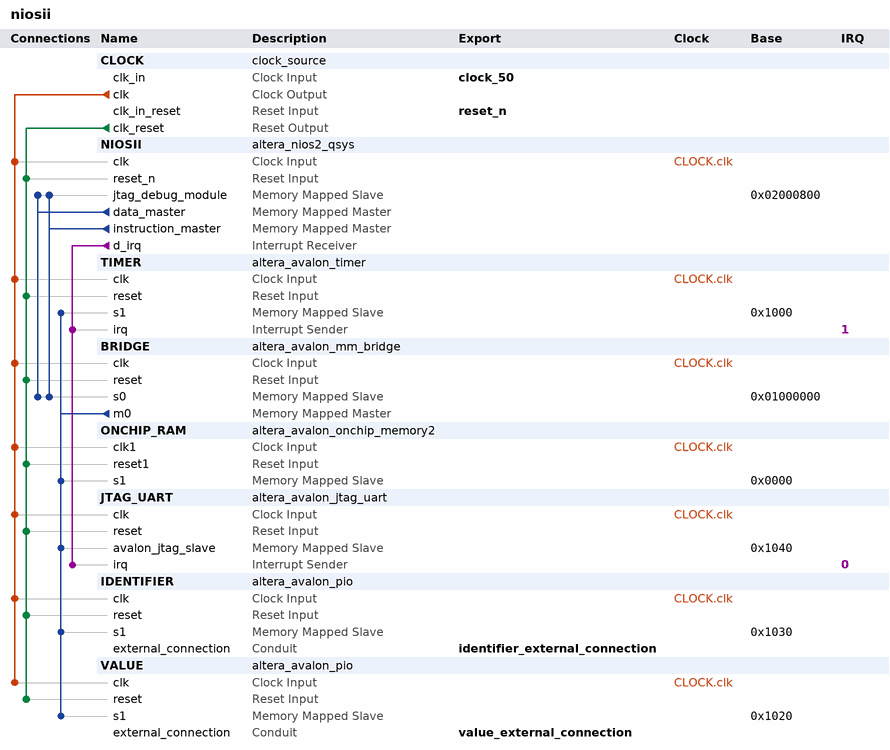
[diagram p0: system contents]
# Platform Designer (Qsys) system niosii, Cyclone IV E EP4CE55F23C6
# Parameters at their usual value, and those the tool derives, are not listed.
package require -exact qsys 13.0.1.99.2
create_system niosii
set_project_property DEVICE_FAMILY {Cyclone IV E}
set_project_property DEVICE EP4CE55F23C6

add_instance CLOCK clock_source 13.0
set_instance_parameter_value CLOCK clockFrequency 50000000

add_instance NIOSII altera_nios2_qsys 13.0
set_instance_parameter_value NIOSII resetSlave ONCHIP_RAM.s1
set_instance_parameter_value NIOSII mmu_TLBMissExcSlave None
set_instance_parameter_value NIOSII exceptionSlave ONCHIP_RAM.s1
set_instance_parameter_value NIOSII breakSlave NIOSII.jtag_debug_module
set_instance_parameter_value NIOSII impl Tiny
set_instance_parameter_value NIOSII icache_size 4096

add_instance TIMER altera_avalon_timer 13.0.1.99.2
set_instance_parameter_value TIMER period 1
set_instance_parameter_value TIMER periodUnits MSEC

add_instance BRIDGE altera_avalon_mm_bridge 13.0
set_instance_parameter_value BRIDGE DATA_WIDTH 32
set_instance_parameter_value BRIDGE ADDRESS_WIDTH 16
set_instance_parameter_value BRIDGE ADDRESS_UNITS SYMBOLS
set_instance_parameter_value BRIDGE MAX_PENDING_RESPONSES 4

add_instance ONCHIP_RAM altera_avalon_onchip_memory2 13.0.1.99.2
set_instance_parameter_value ONCHIP_RAM dataWidth 32
set_instance_parameter_value ONCHIP_RAM dualPort false
set_instance_parameter_value ONCHIP_RAM initMemContent true
set_instance_parameter_value ONCHIP_RAM initializationFileName onchip_mem.hex
set_instance_parameter_value ONCHIP_RAM memorySize 4096

add_instance JTAG_UART altera_avalon_jtag_uart 13.0.1.99.2
set_instance_parameter_value JTAG_UART simInteractiveOptions NO_INTERACTIVE_WINDOWS

add_instance IDENTIFIER altera_avalon_pio 13.0.1.99.2
set_instance_parameter_value IDENTIFIER direction Output
set_instance_parameter_value IDENTIFIER width 32

add_instance VALUE altera_avalon_pio 13.0.1.99.2
set_instance_parameter_value VALUE direction Output
set_instance_parameter_value VALUE width 32

# connections
add_connection CLOCK.clk BRIDGE.clk clock
add_connection CLOCK.clk IDENTIFIER.clk clock
add_connection CLOCK.clk JTAG_UART.clk clock
add_connection CLOCK.clk NIOSII.clk clock
add_connection CLOCK.clk ONCHIP_RAM.clk1 clock
add_connection CLOCK.clk TIMER.clk clock
add_connection CLOCK.clk VALUE.clk clock
add_connection CLOCK.clk_reset BRIDGE.reset reset
add_connection CLOCK.clk_reset IDENTIFIER.reset reset
add_connection CLOCK.clk_reset JTAG_UART.reset reset
add_connection CLOCK.clk_reset NIOSII.reset_n reset
add_connection CLOCK.clk_reset ONCHIP_RAM.reset1 reset
add_connection CLOCK.clk_reset TIMER.reset reset
add_connection CLOCK.clk_reset VALUE.reset reset
add_connection BRIDGE.m0 IDENTIFIER.s1 avalon
set_connection_parameter_value BRIDGE.m0/IDENTIFIER.s1 baseAddress 0x1030
add_connection BRIDGE.m0 JTAG_UART.avalon_jtag_slave avalon
set_connection_parameter_value BRIDGE.m0/JTAG_UART.avalon_jtag_slave baseAddress 0x1040
add_connection BRIDGE.m0 ONCHIP_RAM.s1 avalon
set_connection_parameter_value BRIDGE.m0/ONCHIP_RAM.s1 baseAddress 0x0000
add_connection BRIDGE.m0 TIMER.s1 avalon
set_connection_parameter_value BRIDGE.m0/TIMER.s1 baseAddress 0x1000
add_connection BRIDGE.m0 VALUE.s1 avalon
set_connection_parameter_value BRIDGE.m0/VALUE.s1 baseAddress 0x1020
add_connection NIOSII.data_master BRIDGE.s0 avalon
set_connection_parameter_value NIOSII.data_master/BRIDGE.s0 baseAddress 0x01000000
add_connection NIOSII.data_master NIOSII.jtag_debug_module avalon
set_connection_parameter_value NIOSII.data_master/NIOSII.jtag_debug_module baseAddress 0x02000800
add_connection NIOSII.instruction_master BRIDGE.s0 avalon
set_connection_parameter_value NIOSII.instruction_master/BRIDGE.s0 baseAddress 0x01000000
add_connection NIOSII.instruction_master NIOSII.jtag_debug_module avalon
set_connection_parameter_value NIOSII.instruction_master/NIOSII.jtag_debug_module baseAddress 0x02000800
add_connection NIOSII.d_irq JTAG_UART.irq interrupt
set_connection_parameter_value NIOSII.d_irq/JTAG_UART.irq irqNumber 0
add_connection NIOSII.d_irq TIMER.irq interrupt
set_connection_parameter_value NIOSII.d_irq/TIMER.irq irqNumber 1

# exported interfaces
add_interface clock_50 clock sink
set_interface_property clock_50 EXPORT_OF CLOCK.clk_in
add_interface reset_n reset sink
set_interface_property reset_n EXPORT_OF CLOCK.clk_in_reset
add_interface identifier_external_connection conduit end
set_interface_property identifier_external_connection EXPORT_OF IDENTIFIER.external_connection
add_interface value_external_connection conduit end
set_interface_property value_external_connection EXPORT_OF VALUE.external_connection

set_interconnect_requirement {$system} qsys_mm.clockCrossingAdapter HANDSHAKE
set_interconnect_requirement {$system} qsys_mm.maxAdditionalLatency 1

save_system niosii.qsys
